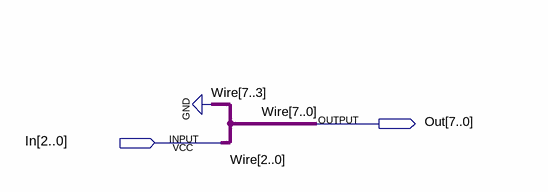
[diagram p0: schematic sheet]
// Quartus schematic ZeroFill.bdf as structural Verilog: 0 symbols, 2 pins
module ZeroFill (
  input  [2:0] In,
  output [7:0] Out
);


  assign Out = {{5{1'b0}}, In};

  // Other names for the same wires on the sheet: Wire[2:0] = In
endmodule
